# Altium project Common_Sensor_Box.PrjPCB (part 5 of 17)

## Sheet Sensor_Box_PoE.SchDoc: Title
size 420 x 297 mm; Author: G.Kasprowicz; CompanyName: WUT ISE; DrawnBy: G.Kasprowicz; Organization: WUT ISE; Address1: PW ISE; Address2: Nowowiejska 15/19 00-665 Warsaw; Address3: gkasprow@gmail.com; Revision: 1.0; SheetNumber: -; SheetTotal: -; ModifiedBy: -; CheckedDate: -; Title2: Title2; DivGrp: WUT ISE; Designer: G.Kasprowicz; ModifiedDate: -; ProjectName: Sensor Box
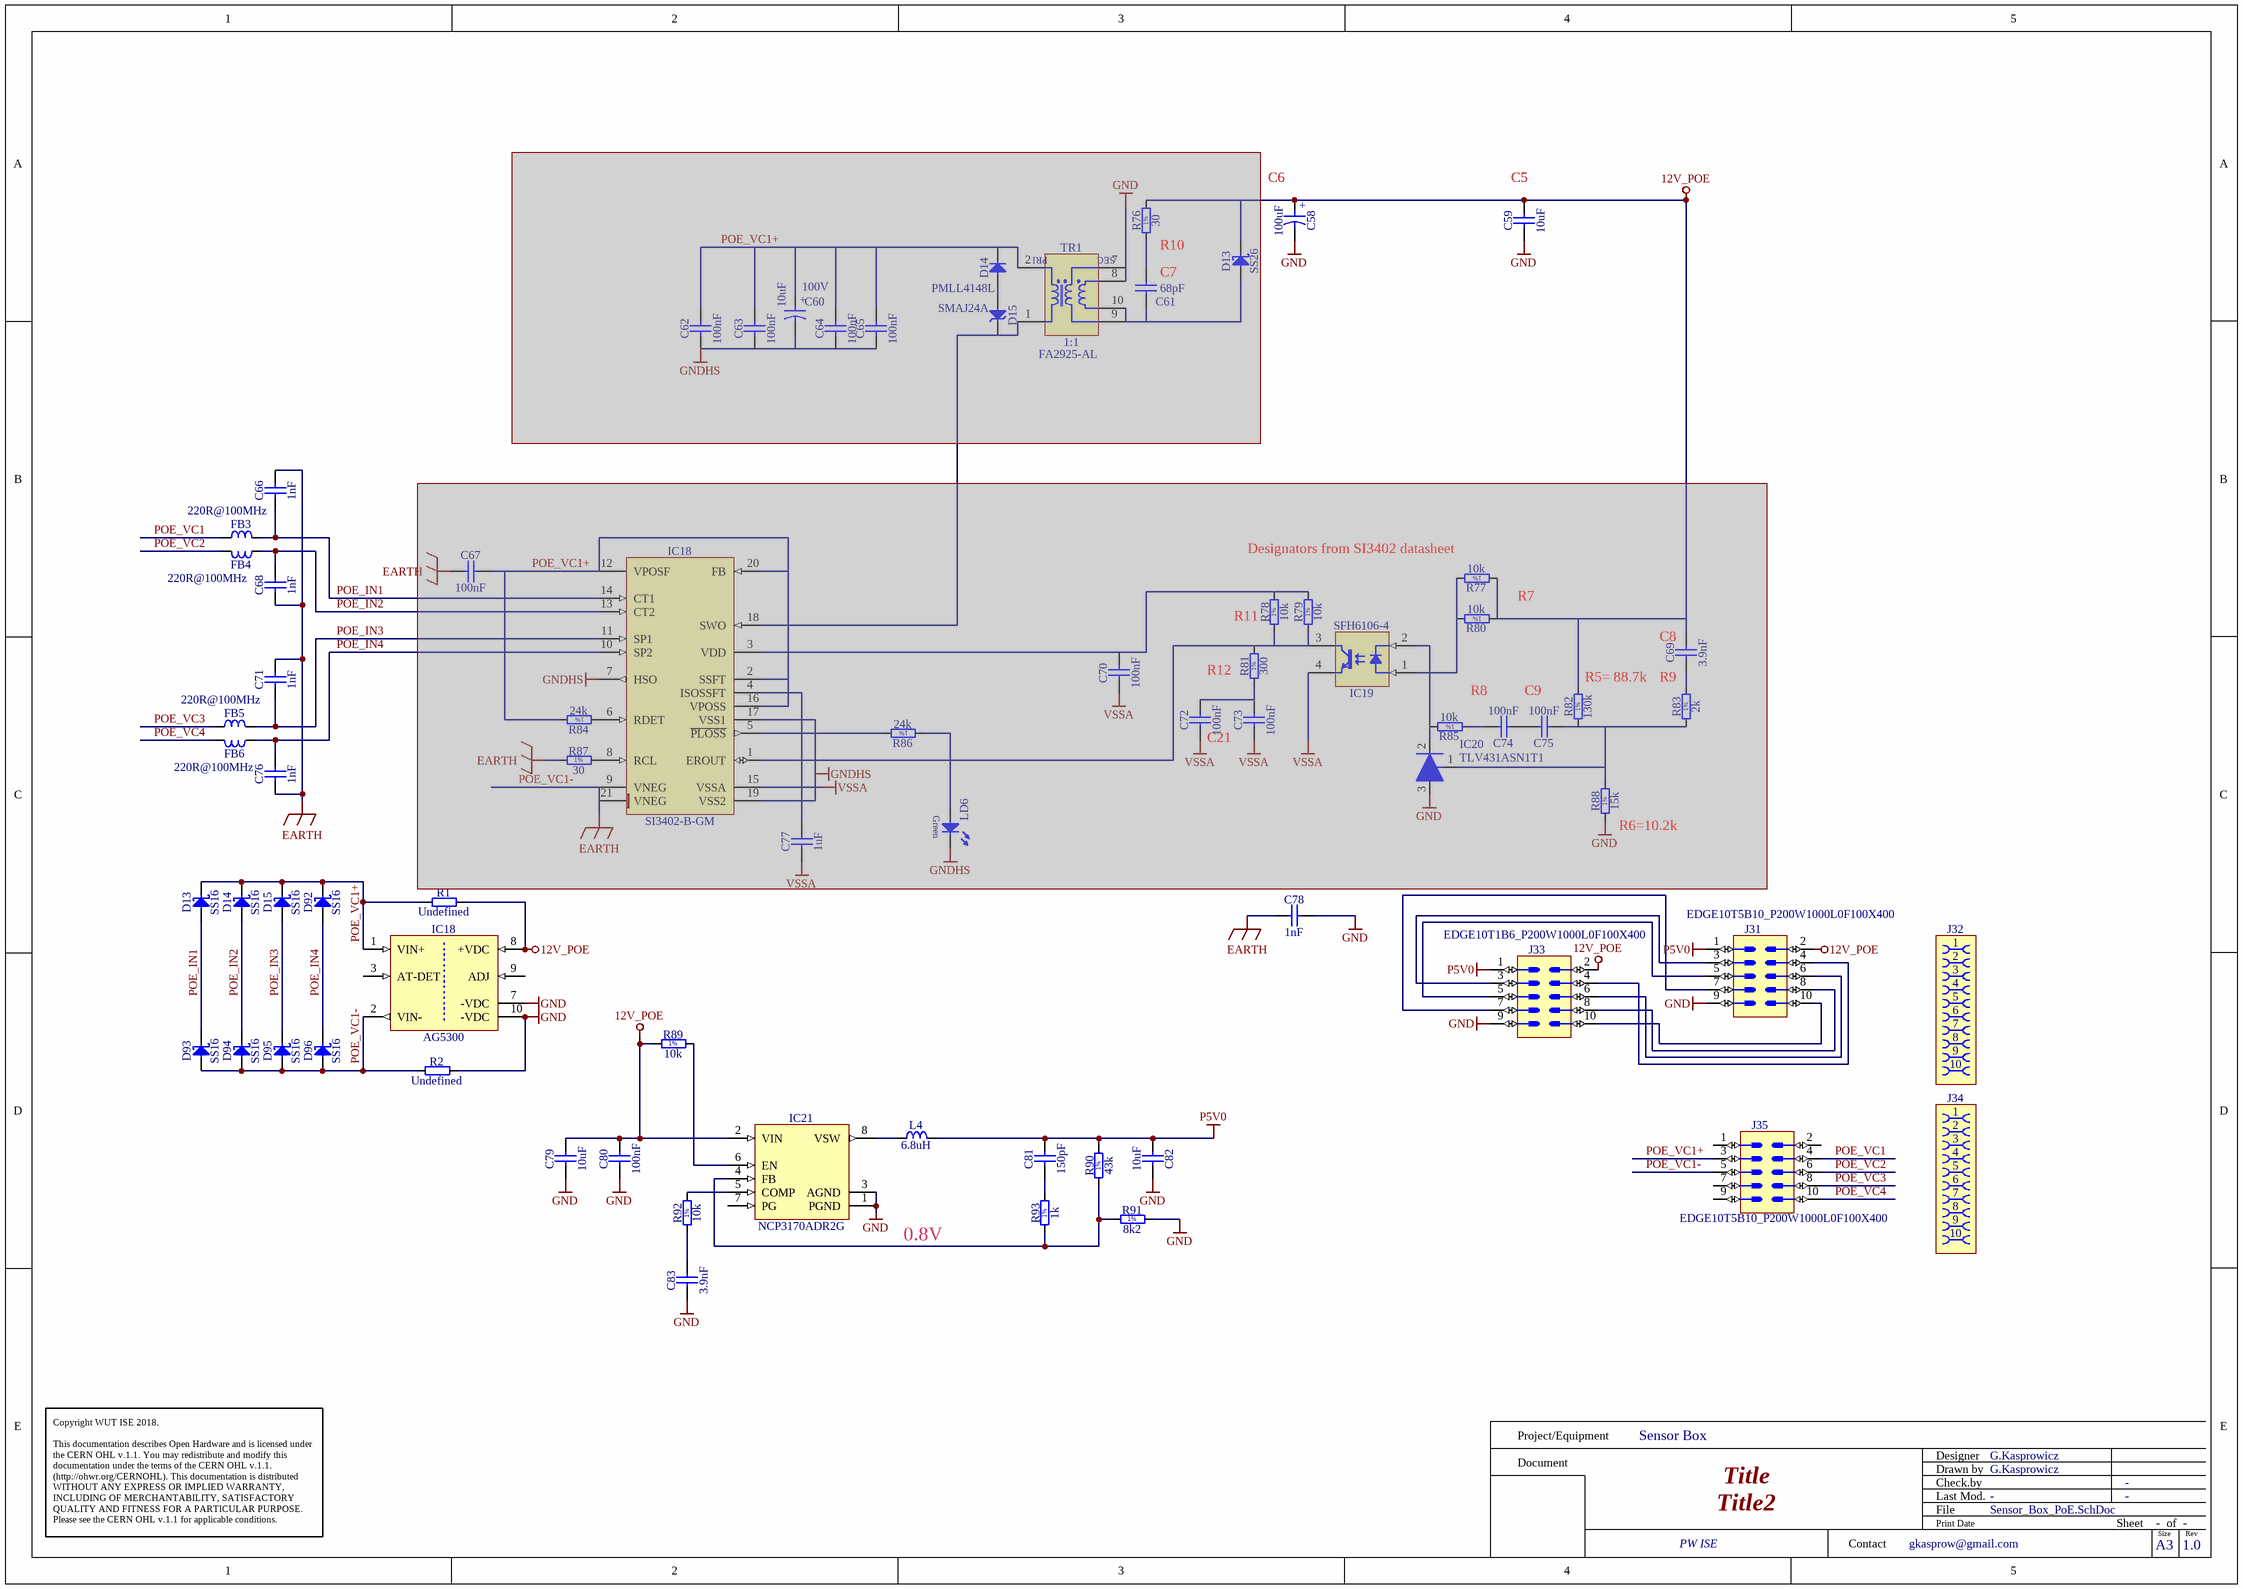
[diagram p7: Sensor_Box_PoE.SchDoc]

### Parts
(Parts that share a designator on the sheet are numbered #1, #2 ... from top to bottom, then left to right.)
C58  100uF  [CAPAE660X540N]
C59  10uF  [CAPC2012X135N]
C60#2  10uF  Voltage: 100V  [CAPAE830X1020N]  (masked out: inside a compile mask, not in the netlist)
C61#1  68pF  [CAPC1608X87N]  (masked out: inside a compile mask, not in the netlist)
C62#1  100nF  [CAPC3216X140N]  (masked out: inside a compile mask, not in the netlist)
C63#1  100nF  [CAPC3216X140N]  (masked out: inside a compile mask, not in the netlist)
C64#1  100nF  [CAPC3216X140N]  (masked out: inside a compile mask, not in the netlist)
C65#1  100nF  [CAPC3216X140N]  (masked out: inside a compile mask, not in the netlist)
C66  1nF  [CAPC1608X87N]
C67#1  100nF  [CAPC3216X140N]  (masked out: inside a compile mask, not in the netlist)
C68  1nF  [CAPC1608X87N]
C69#1  3.9nF  [CAPC1608X87N]  (masked out: inside a compile mask, not in the netlist)
C70#1  100nF  [CAPC1005X55N]  (masked out: inside a compile mask, not in the netlist)
C71  1nF  [CAPC1608X87N]
C72#1  100nF  [CAPC1005X55N]  (masked out: inside a compile mask, not in the netlist)
C73#1  100nF  [CAPC1005X55N]  (masked out: inside a compile mask, not in the netlist)
C74#1  100nF  [CAPC1005X55N]  (masked out: inside a compile mask, not in the netlist)
C75#1  100nF  [CAPC1005X55N]  (masked out: inside a compile mask, not in the netlist)
C76  1nF  [CAPC1608X87N]
C77#1  1uF  [CAPC1005X55N]  (masked out: inside a compile mask, not in the netlist)
C78  1nF  [CAPC3216X180N]
C79  10uF  [CAPC2012X135N]
C80  100nF  [CAPC1005X55N]
C81  150pF  [CAPC1608X87N]
C82  10uF  [CAPC2012X135N]
C83  3.9nF  [CAPC1608X87N]
D13#1  SS26  [DIOM5336X265N]  (masked out: inside a compile mask, not in the netlist)
D13#2  SS16  [DIOM5127X229N]
D14#1  PMLL4148L  [DIOMELF3515N]  (masked out: inside a compile mask, not in the netlist)
D14#2  SS16  [DIOM5127X229N]
D15#1  SMAJ24A  [DIOM5226X262N]  (masked out: inside a compile mask, not in the netlist)
D15#2  SS16  [DIOM5127X229N]
D92  SS16  [DIOM5127X229N]
D93  SS16  [DIOM5127X229N]
D94  SS16  [DIOM5127X229N]
D95  SS16  [DIOM5127X229N]
D96  SS16  [DIOM5127X229N]
FB3  220R@100MHz  [INDC2012X105N]
FB4  220R@100MHz  [INDC2012X105N]
FB5  220R@100MHz  [INDC2012X105N]
FB6  220R@100MHz  [INDC2012X105N]
IC18#1  SI3402-B-GM  [QFN80P500X500X80-21N-S280]  (masked out: inside a compile mask, not in the netlist)
IC18#2  AG5300  [SILVERTEL_AG5300]
IC19#1  SFH6106-4  [SOIC254P977X406-4N]  (masked out: inside a compile mask, not in the netlist)
IC20#1  TLV431ASN1T1  [SOT-23]  (masked out: inside a compile mask, not in the netlist)
IC21  NCP3170ADR2G  [SOIC127P600X175-8N]
J31  (no value)  [EDGE10T5B10_P200W1000L0F100X400]
J32  (no value)  [AVX_00 9159 010 061 916]
J33  (no value)  [EDGE10T1B6_P200W1000L0F100X400]
J34  (no value)  [AVX_00 9159 010 061 916]
J35  (no value)  [EDGE10T5B10_P200W1000L0F100X400]
L4  6.8uH  [IND_BOURNS_SRU8043]
LD6#1  Green  [LED_KINGBRIGHT_KPTR3216]  (value not drawn)  (masked out: inside a compile mask, not in the netlist)
R1  Undefined  [RESC3216X65N]
R2  Undefined  [RESC3216X65N]
R76#1  30  [RESC1608X55N]  (masked out: inside a compile mask, not in the netlist)
R77#1  10k  [RESC1005X40N]  (masked out: inside a compile mask, not in the netlist)
R78#1  10k  [RESC1005X40N]  (masked out: inside a compile mask, not in the netlist)
R79#1  10k  [RESC1005X40N]  (masked out: inside a compile mask, not in the netlist)
R80#1  10k  [RESC1005X40N]  (masked out: inside a compile mask, not in the netlist)
R81#1  300  [RESC1005X40N]  (masked out: inside a compile mask, not in the netlist)
R82#1  130k  [RESC1608X55N]  (masked out: inside a compile mask, not in the netlist)
R83#1  2k  [RESC1005X40N]  (masked out: inside a compile mask, not in the netlist)
R84#1  24k  [RESC1608X55N]  (masked out: inside a compile mask, not in the netlist)
R85#2  10k  [RESC1005X40N]  (masked out: inside a compile mask, not in the netlist)
R86#2  24k  [RESC1608X55N]  (masked out: inside a compile mask, not in the netlist)
R87#1  30  [RESC1608X55N]  (masked out: inside a compile mask, not in the netlist)
R88#1  15k  [RESC1608X55N]  (masked out: inside a compile mask, not in the netlist)
R89  10k  [RESC1005X40N]
R90  43k  [RESC1608X55N]
R91  8k2  [RESC1608X55N]
R92  10k  [RESC1005X40N]
R93  1k  [RESC1005X40N]
TR1  1:1  Manufacturer Part Number: FA2925-AL  [XFMR_COILCRAFT_FA2925-AL]  (masked out: inside a compile mask, not in the netlist)

### Nets
12V_POE: C58.1 C59.2 C79.2 C80.2 IC18#2.8(+VDC) IC21.2(VIN) J31.2 J33.2 R1.2 R89.1
EARTH: C66.2 C68.1 C71.2 C76.1 C78.1
GND: C58.2 C59.1 C78.2 C79.1 C80.1 C82.2 C83.1 IC18#2.7(-VDC) IC18#2.10(-VDC) IC21.1(PGND) IC21.3(AGND) J31.9 J33.9 R2.2 R91.2
P5V0: C81.2 C82.1 J31.1 J33.1 L4.2 R90.2
POE_IN1: C66.1 D13#2.2(A) D93.1(C) FB3.2
POE_IN2: C68.2 D14#2.2(A) D94.1(C) FB4.1
POE_IN3: C71.1 D15#2.2(A) D95.1(C) FB5.2
POE_IN4: C76.2 D92.2(A) D96.1(C) FB6.1
POE_VC1: FB3.1 J35.4
POE_VC1+: D13#2.1(C) D14#2.1(C) D15#2.1(C) D92.1(C) IC18#2.1(VIN+) J35.3 R1.1
POE_VC1-: D93.2(A) D94.2(A) D95.2(A) D96.2(A) IC18#2.2(VIN-) J35.5 R2.1
POE_VC2: FB4.2 J35.6
POE_VC3: FB5.1 J35.8
POE_VC4: FB6.2 J35.10
NetC81_1: C81.1 R93.2
NetC83_2: C83.2 R92.1
NetIC21_4: IC21.4(FB) R90.1 R91.1 R93.1
NetIC21_5: IC21.5(COMP) R92.2
NetIC21_6: IC21.6(EN) R89.2
NetIC21_8: IC21.8(VSW) L4.1
NetJ31_3: J31.3 J33.3
NetJ31_4: J31.4 J33.4
NetJ31_5: J31.5 J33.5
NetJ31_6: J31.6 J33.6
NetJ31_7: J31.7 J33.7
NetJ31_8: J31.8 J33.8
NetJ31_10: J31.10 J33.10

Not connected (* = marked no-connect by the designer): IC18#2 3(AT-DET) 9(ADJ); IC21 7(PG); J35 1 2 7 9

### Notes on the sheet
- (near C58) C6
- (near C59) C5
- (near R76#1) R10
- (near C61#1) C7
- (near R77#1) Designators from SI3402 datasheet
- R11
- R7
- (near C69#1) C8
- R12
- R8
- C9
- (near R82#1) R5= 88.7k
- R9
- (near C72#1) C21
- (near R88#1) R6=10.2k
- 0.8V
- Project/Equipment
- Document
- Designer
- Drawn by
- Check.by
- Copyright WUT ISE 2018.
  This documentation describes Open Hardware and is licensed under the CERN OHL v.1.1. You may redistribute and modify this documentation under the terms of the CERN OHL v.1.1. (http://ohwr.org/CERNOHL). This documentation is distributed WITHOUT ANY EXPRESS OR IMPLIED WARRANTY, INCLUDING OF MERCHANTABILITY, SATISFACTORY QUALITY AND FITNESS FOR A PARTICULAR PURPOSE. Please see the CERN OHL v.1.1 for applicable conditions.
- Contact
- File
- Last Mod.
- Print Date
- Sheet
- Size
- A3
- of
- Rev
- (in symbol CAE660-540_100UF_16V_20%) +
- (in symbol CAP_ELECTRO_SMD_F_10u_100V) +
- (in symbol R0402_1K_1%_0.0625W_100PPM) 1%
- (in symbol R0402_2K_1%_0.0625W_100PPM) 1%
- (in symbol R0402_10K_1%_0.0625W_100PPM) 1%
- (in symbol R0402_300R_1%_0.0625W_100PPM) 1%
- (in symbol R0603_8K2_1%_0.1W_100PPM) 1%
- (in symbol R0603_15K_1%_0.1W_100PPM) 1%
- (in symbol R0603_24K_1%_0.1W_100PPM) 1%
- (in symbol R0603_30R_1%_0.1W_100PPM) 1%
- (in symbol R0603_43K_1%_0.1W_100PPM) 1%
- (in symbol R0603_130K_1%_0.1W_100PPM) 1%
- (in symbol XFMR_COILCRAFT_FA2925-AL) PRI; SEC

### Library data of the parts
C58 = CAE660-540_100UF_16V_20%: Polarised capacitor; Part Description: Aluminum Electrolytic SMT Capacitor; Manufacturer: PANASONIC; Manufacturer Part Number: EEEFK1C101AP; Voltage: 16V; Tolerance: ±20%; Part Number: CAE660-540_100UF_16V_20%; Component Kind: Standard; Component Type: Standard; Pin Count: 2; Value: 100uF; Status: Not Recommended; Case: D; Mounted: Yes; Socket: No; SMD: Yes; Sense: No; ComponentHeight: 5.8mm; HelpURL: \\cern.ch\dfs\Applications\Altium\Datasheets\CAE_PANASONIC_FK.pdf; Author: CERN DEM JLC; CreateDate: 03.12.2007; LatestRevisionDate: 05.11.2014
C59 C79 C82 = CC0805_10UF_16V_10%_X5R: as C56 on sheet Sensor_Box_Hub_SAMD21; Part Number: CC0805_10UF_16V_10%_X5R; Component Kind: Standard; Component Type: Standard; Pin Count: 2; Value: 10uF; Status: Preferred; Manufacturer Part Number: CC0805_10UF_16V_10%_X5R; Case: 0805; Mounted: Yes; Socket: No; SMD: Yes; Sense: No; Manufacturer1 Example: KEMET; Manufacturer1 ComponentHeight: 1.4mm; HelpURL: \\cern.ch\dfs\Applications\Altium\Datasheets\CC1206_X5R_KEMET.pdf; Author: CERN DEM JLC; CreateDate: 03.12.2007; LatestRevisionDate: 03.12.2007
C60#2 = CAP_ELECTRO_SMD_F_10u_100V: 10uF, 100V, 1.5R; Part Number: CAE830-1020_10UF_100V_20%; Part Description: Aluminum Electrolytic SMT Capacitor; Manufacturer: PANASONIC; Manufacturer Part Number: EEEHD2A100P; Tolerance: ±20%; Table: Capacitors SMD; Component Kind: Standard; Component Type: Standard; Pin Count: 2; Value: 10uF; Status: Recommended; Case: F; Mounted: Yes; Socket: No; SMD: Yes; ComponentHeight: 10.2mm; HelpURL: \\cern.ch\dfs\Applications\Altium\Datasheets\CAE_PANASONIC_FK.pdf; Author: CERN DEM JLC; CreateDate: 2007-12-03; LatestRevisionDate: 2014-11-05
C61#1 = CC0603_68PF_50V_5%_NP0: as C57 on sheet Sensor_Box_Hub_SAMD21; Part Number: CC0603_68PF_50V_5%_NP0; Component Kind: Standard; Component Type: Standard; Pin Count: 2; Value: 68pF; Status: Preferred; Manufacturer Part Number: CC0603_68PF_50V_5%_NP0; Case: 0603; Mounted: Yes; Socket: No; SMD: Yes; Sense: No; Manufacturer1 Example: PHYCOMP; Manufacturer1 ComponentHeight: 0.87mm; HelpURL: \\cern.ch\dfs\Applications\Altium\Datasheets\CC0603_NP0_PHYCOMP.pdf; Author: CERN DEM JLC; CreateDate: 03.12.2007; LatestRevisionDate: 03.12.2007
C62#1 C63#1 C64#1 C65#1 C67#1 = CC1206_100NF_100V_10%_X7R: Non-polarised capacitor; Part Description: SMD Multilayer Chip Ceramic Capacitor; Manufacturer: GENERIC; Manufacturer1 Part Number: 222260115649; Voltage: 100V; TC: X7R; Tolerance: ±10%; Part Number: CC1206_100NF_100V_10%_X7R; Component Kind: Standard; Component Type: Standard; Pin Count: 2; Value: 100nF; Status: Preferred; Manufacturer Part Number: CC1206_100NF_100V_10%_X7R; Case: 1206; Mounted: Yes; Socket: No; SMD: Yes; Sense: No; Manufacturer1 Example: PHYCOMP; Manufacturer1 ComponentHeight: 1.25mm; HelpURL: \\cern.ch\dfs\Applications\Altium\Datasheets\CC1206_X7R_PHYCOMP.pdf; Author: CERN DEM JLC; CreateDate: 24.08.2009; LatestRevisionDate: 24.08.2009
C66 C68 C71 C76 = CC0603_1NF_100V_10%_X7R: Non-polarised capacitor; Part Description: SMD Multilayer Chip Ceramic Capacitor; Manufacturer: GENERIC; Manufacturer1 Part Number: C0603C102K1RACTU; Voltage: 100V; TC: X7R; Tolerance: ±10%; Part Number: CC0603_1NF_100V_10%_X7R; Component Kind: Standard; Component Type: Standard; Pin Count: 2; Value: 1nF; Status: Preferred; Manufacturer Part Number: CC0603_1NF_100V_10%_X7R; Case: 0603; Mounted: Yes; Socket: No; SMD: Yes; Sense: No; Manufacturer1 Example: KEMET; Manufacturer1 ComponentHeight: 0.87mm; HelpURL: \\cern.ch\dfs\Applications\Altium\Datasheets\CC0603_X7R_KEMET.pdf; Author: CERN DEM JLC; CreateDate: 12.12.2013; LatestRevisionDate: 12.12.2013
C69#1 C83 = CC0603_3.9NF_50V_5%_X7R: Non-polarised capacitor; Part Description: SMD Multilayer Chip Ceramic Capacitor; Manufacturer: GENERIC; Manufacturer1 Part Number: 223858615631; Voltage: 50V; TC: X7R; Tolerance: ±5%; Part Number: CC0603_3.9NF_50V_5%_X7R; Component Kind: Standard; Component Type: Standard; Pin Count: 2; Value: 3.9nF; Status: Preferred; Manufacturer Part Number: CC0603_3.9NF_50V_5%_X7R; Case: 0603; Mounted: Yes; Socket: No; SMD: Yes; Sense: No; Manufacturer1 Example: PHYCOMP; Manufacturer1 ComponentHeight: 0.87mm; HelpURL: \\cern.ch\dfs\Applications\Altium\Datasheets\CC0603_X7R_PHYCOMP.pdf; Author: CERN DEM JLC; CreateDate: 03.12.2007; LatestRevisionDate: 03.12.2007
C70#1 C72#1 C73#1 C74#1 C75#1 C80 = CC0402_100NF_16V_10%_X5R: as C41 on sheet Sensor_Box_Hub_SAMD21; Part Number: CC0402_100NF_16V_10%_X5R; Component Kind: Standard; Component Type: Standard; Pin Count: 2; Value: 100nF; Status: None; Manufacturer Part Number: CC0402_100NF_16V_10%_X5R; Case: 0402; Mounted: Yes; Socket: No; SMD: Yes; Sense: No; Manufacturer1 Example: MURATA; Manufacturer1 ComponentHeight: 0.55mm; HelpURL: \\cern.ch\dfs\Applications\Altium\Datasheets\CC0402_X5R_MURATA_GRM.pdf; Author: CERN DEM JLC; CreateDate: 10.12.2013; LatestRevisionDate: 10.12.2013
C77#1 = CC0402_1UF_16V_10%_X5R: as C55 on sheet Sensor_Box_Hub_SAMD21; Part Number: CC0402_1UF_16V_10%_X5R; Component Kind: Standard; Component Type: Standard; Pin Count: 2; Value: 1uF; Status: Preferred; Manufacturer Part Number: CC0402_1UF_16V_10%_X5R; Case: 0402; Mounted: Yes; Socket: No; SMD: Yes; Sense: No; Manufacturer1 Example: TDK; Manufacturer1 ComponentHeight: 0.55mm; HelpURL: \\cern.ch\dfs\Applications\Altium\Datasheets\CC0402_X5R_TDK_C.pdf; Author: CERN DEM JLC; CreateDate: 25.10.2012; LatestRevisionDate: 25.10.2012
C78 = CC1206_1NF_2KV_10%_X7R: Non-polarised capacitor; Part Description: High Voltage MLC Chip Capacitor; Manufacturer: GENERIC; Manufacturer1 Part Number: 1206GC102KAT2A; Voltage: 2kV; TC: X7R; Tolerance: ±10%; Part Number: CC1206_1NF_2KV_10%_X7R; Component Kind: Standard; Component Type: Standard; Pin Count: 2; Value: 1nF; Status: None; Manufacturer Part Number: CC1206_1NF_2KV_10%_X7R; Case: 1206; Mounted: Yes; Socket: No; SMD: Yes; Sense: No; Manufacturer1 Example: AVX; Manufacturer1 ComponentHeight: 1.8mm; HelpURL: \\cern.ch\dfs\Applications\Altium\Datasheets\CC1206_X7R_AVX_HV-MLC.pdf; Author: CERN DEM JLC; CreateDate: 19.11.2012; LatestRevisionDate: 17.05.2017
C81 = CC0603_150PF_50V_1%_NP0: Non-polarised capacitor; Part Description: SMD Multilayer Chip Ceramic Capacitor; Manufacturer: GENERIC; Manufacturer1 Part Number: CC0603FRNPO9BN151; Voltage: 50V; TC: C0G/NP0; Tolerance: ±1%; Part Number: CC0603_150PF_50V_1%_NP0; Component Kind: Standard; Component Type: Standard; Pin Count: 2; Value: 150pF; Status: None; Manufacturer Part Number: CC0603_150PF_50V_1%_NP0; Case: 0603; Mounted: Yes; Socket: No; SMD: Yes; Sense: No; Manufacturer1 Example: PHYCOMP; Manufacturer1 ComponentHeight: 0.7mm; HelpURL: \\cern.ch\dfs\Applications\Altium\Datasheets\CC0805_NP0_PHYCOMP_16VTO50V.pdf; Author: CERN DEM MR; CreateDate: 17.02.2016; LatestRevisionDate: 17.02.2016
D13#1 = SS26: Schottky Diode; Part Description: Schottky Rectifier; Manufacturer: FAIRCHILD SEMICONDUCTOR; Voltage: 60V; Power: 2A; PressFit: No; Bonding: No; Part Number: SS26; Component Kind: Standard; Component Type: Standard; Device: SS26; PackageDescription: DO-214-AA/SMB Diode, Molded Body; 5.34mm L X 3.625mm W X 2.65mm H, IPC Medium Density; Manufacturer Part Number: SS26; Pin Count: 2; Case: DO-214AA; Mounted: Yes; Socket: No; SMD: Yes; Sense: No; ComponentHeight: 2.65mm; HelpURL: \\cern.ch\dfs\Applications\Altium\Datasheets\SS26.pdf; Author: CERN DEM JMW; CreateDate: 10.07.2015; LatestRevisionDate: 10.07.2015
D13#2 D14#2 D15#2 D92-D96 = SS16: Schottky Diode; Part Description: Surface Mount Schottky Barrier Rectifier; Manufacturer: VISHAY GENERAL SEMICONDUCTOR; Voltage: 60V; Power: 1A; PressFit: No; Bonding: No; Part Number: SS16; Component Kind: Standard; Component Type: Standard; Device: SS16; PackageDescription: DO-214-AC Molded Diode, Body 5.1x2.7mm, IPC Medium Density; Manufacturer Part Number: SS16; Pin Count: 2; Case: DO-214AC; Mounted: Yes; Socket: No; SMD: Yes; Sense: No; ComponentHeight: 2.29mm; HelpURL: \\cern.ch\dfs\Applications\Altium\Datasheets\SS16.pdf; Author: CERN DEM JLC; CreateDate: 15.07.2008; LatestRevisionDate: 23.08.2010
D14#1 = PMLL4148L: Diode; Part Description: High-speed switching diodes; Manufacturer: NXP SEMICONDUCTORS; Voltage: 75V; Power: 200mA; PressFit: No; Bonding: No; Part Number: PMLL4148L; Component Kind: Standard; Component Type: Standard; Device: PMLL4148L; PackageDescription: SOD80C, MELF Diode, 2-Leads, Body 3.5x1.5mm, IPC Medium Density; Status: Not recommended; Manufacturer Part Number: PMLL4148L; Pin Count: 2; Case: SOD-80C; Mounted: Yes; Socket: No; SMD: Yes; Sense: No; ComponentHeight: 1.6mm; HelpURL: \\cern.ch\dfs\Applications\Altium\Datasheets\PMLL4148L.pdf; Author: CERN DEM JLC; CreateDate: 30.03.2009; LatestRevisionDate: 09.12.2009
D15#1 = SMAJ24A: Transient Voltage Suppressor Diode (Uni-Directional); Part Description: Surface Mount Uni-directional Transient Voltage Suppressor Diode; Manufacturer: BOURNS; Voltage: 24V; Power: 400W; PressFit: No; Bonding: No; Part Number: SMAJ24A; Component Kind: Standard; Component Type: Standard; Device: SMAJ24A; PackageDescription: DO-214-AC/SMA Diode, Molded Body; 5.21mm L X 2.605mm W X 2.62mm H, IPC Medium Density; Manufacturer Part Number: SMAJ24A; Pin Count: 2; Case: DO-214AC; Mounted: Yes; Socket: No; SMD: Yes; Sense: No; ComponentHeight: 2.62mm; HelpURL: \\cern.ch\dfs\Applications\Altium\Datasheets\SMAJ24A.pdf; Author: CERN DEM JLC; CreateDate: 27.06.2011; LatestRevisionDate: 27.06.2011
FB3-FB6 = IND0805_MURATA_BLM21PG221SN1D: as FB2 on sheet Sensor_Box_Hub_SAMD21; Part Number: IND0805_MURATA_BLM21PG221SN1D; Component Kind: Standard; Component Type: Standard; Pin Count: 2; Value: 220R@100MHz; Status: None; Manufacturer Part Number: BLM21PG221SN1D; Case: 0805; Mounted: Yes; Socket: No; SMD: Yes; ComponentHeight: 1.05mm; HelpURL: \\cern.ch\dfs\Applications\Altium\Datasheets\IND0402_MURATA_BLM21P.pdf; Author: CERN DEM JLC; CreateDate: 2010-01-25; LatestRevisionDate: 2010-01-25
IC18#1 = SI3402-B-GM: Fully Integrated IEEE 802.3 Compliant PoE PD Interface and Low-EMI Switching Regulator; Manufacturer: SILICON LABS; PressFit: No; Bonding: No; Part Number: SI3402-B-GM; Component Kind: Standard; Component Type: Standard; Device: SI3402-B-GM; PackageDescription: QFN, 0.80mm Pitch, Square 20 Pin, 5.00mm L X 5.00mm W X 0.80mm H body (W/Thermal Tab 2.8mm X 2.8mm), IPC Medium Density; Part Description: Fully Integrated IEEE 802.3 Compliant PoE PD Interface and Low-EMI Switching Regulator; Manufacturer Part Number: SI3402-B-GM; Pin Count: 21; Case: QFN20; Mounted: Yes; Socket: No; SMD: Yes; Sense: No; ComponentHeight: 0.8mm; HelpURL: \\cern.ch\dfs\Applications\Altium\Datasheets\SI3402-B-GM.pdf; Author: CERN DEM MR; CreateDate: 21.02.2018; LatestRevisionDate: 21.02.2018
IC18#2 = AG5300: Power-over-Ethernet Plus (POE+) Module; Part Description: 12V 30W Power-over-Ethernet Plus (POE+); Manufacturer: SILVERTEL; PressFit: No; Bonding: No; Part Number: AG5300; Component Kind: Standard; Component Type: Standard; Device: AG5300; PackageDescription: Power-over-Ethernet Plus (POE+) Module, Body L 57.3mm x W 18mm x H 14mm; Manufacturer Part Number: AG5300; Pin Count: 10; Mounted: Yes; Socket: No; SMD: No; Sense: No; ComponentHeight: 14mm; HelpURL: \\cern.ch\dfs\Applications\Altium\Datasheets\AG5300.pdf; Author: CERN DEM JLC; CreateDate: 20.03.2018; LatestRevisionDate: 20.03.2018
IC19#1 = SFH6106-4: Single Optocoupler; Part Description: Optocoupler, Phototransistor Output, High Reliability, 5300 VRMS; Manufacturer: VISHAY SEMICONDUCTORS; PressFit: No; Bonding: No; Part Number: SFH6106-4; Component Kind: Standard; Component Type: Standard; Device: SFH6106-4; PackageDescription: SOIC, 2.54mm pitch; 4 pin, 6.65mm W X 4.69mm L, IPC Medium Density; Manufacturer Part Number: SFH6106-4; Pin Count: 4; Case: SOIC4; Mounted: Yes; Socket: No; SMD: Yes; Sense: No; ComponentHeight: 4.06mm; HelpURL: \\cern.ch\dfs\Applications\Altium\Datasheets\SFH6106-4.pdf; Author: CERN DEM MR; CreateDate: 15.02.2018; LatestRevisionDate: 15.02.2018
IC20#1 = REF_TLV431_SOT23_16V: 16V 1.24V ADJ Voltage reference; Supplier 1: Newark; Supplier Part Number 1: 31K7719
IC21 = NCP3170ADR2G: Synchronous PWM Switching Converter; Manufacturer: ON SEMICONDUCTOR; PressFit: No; Bonding: No; Part Number: NCP3170ADR2G; Component Kind: Standard; Component Type: Standard; Device: NCP3170ADR2G; PackageDescription: SOIC 8, Pitch 1.27mm - Body 4x5mm, IPC Medium Density; Part Description: Synchronous PWM Switching Converter; Manufacturer Part Number: NCP3170ADR2G; Pin Count: 8; Case: SOIC8; Mounted: Yes; Socket: No; SMD: Yes; Sense: No; ComponentHeight: 1.75mm; Author: CERN DEM MR; HelpURL: \\cern.ch\dfs\Applications\Altium\Datasheets\NCP3170ADR2G.pdf; CreateDate: 30.05.2016; LatestRevisionDate: 30.05.2016
J31 J35 = EDGE10T5B10_P200W1000L0F100X400: as J26 on sheet Sensor_Box_Hub_SAMD21; Part Number: EDGE10T5B10_P200W1000L0F100X400; Component Kind: Standard (No BOM); Component Type: Standard (No BOM); Pin Count: 10; Socket: No; SMD: No; Sense: No; Status: None; ComponentHeight: 0mm; HelpURL: \\cern.ch\dfs\Applications\Altium\Datasheets\EDGE10T5B10_P200W1000L0F100X400.pdf; Author: CERN DEM MR; CreateDate: 14.02.2018; LatestRevisionDate: 14.02.2018
J32 J34 = AVX_00 9159 010 061 916: Open Ended Card Edge Connector, 9159 Series; Part Description: 10 Contacts, 2mm Pitch, Open Ended Card Edge Connector, 9159 Series; Manufacturer: AVX; PressFit: No; Part Number: AVX_00 9159 010 061 916; Component Kind: Standard; Component Type: Standard; Pin Count: 10; Mounted: Yes; Socket: No; SMD: No; Sense: No; Status: None; Manufacturer Part Number: 00 9159 010 061 916; ComponentHeight: 1.6mm; HelpURL: \\cern.ch\dfs\Applications\Altium\Datasheets\AVX_00 9159 010 061 916.pdf; Author: CERN DEM MR; CreateDate: 13.02.2018; LatestRevisionDate: 13.02.2018
J33 = EDGE10T1B6_P200W1000L0F100X400: as J27 on sheet Sensor_Box_Hub_SAMD21; Part Number: EDGE10T1B6_P200W1000L0F100X400; Component Kind: Standard (No BOM); Component Type: Standard (No BOM); Pin Count: 10; Socket: No; SMD: No; Sense: No; Status: None; ComponentHeight: 0mm; HelpURL: \\cern.ch\dfs\Applications\Altium\Datasheets\EDGE10T1B6_P200W1000L0F100X400.pdf; Author: CERN DEM MR; CreateDate: 14.02.2018; LatestRevisionDate: 14.02.2018
L4 = IND_6.8UH_30%_BOURNS_SRU8043: Inductor; Part Description: Shielded SMD Power Inductor; Manufacturer: BOURNS; Manufacturer Part Number: SRU8043-6R8Y; Power: 3.8A; Resistance: 0.0224R; Tolerance: ±30%; Part Number: IND_6.8UH_30%_BOURNS_SRU8043; Component Kind: Standard; Component Type: Standard; Pin Count: 2; Value: 6.8uH; Status: None; Mounted: Yes; Socket: No; SMD: Yes; Sense: No; ComponentHeight: 4.6mm; HelpURL: \\cern.ch\dfs\Applications\Altium\Datasheets\IND_BOURNS_SRU8043.pdf; Author: CERN DEM JMW; CreateDate: 06.08.2015; LatestRevisionDate: 06.08.2015
LD6#1 = LED_KINGBRIGHT_KPTR-3216CGCK: as LD3-LD5 on sheet Sensor_Box_Hub_SAMD21; Part Number: LED_KINGBRIGHT_KPTR-3216CGCK; Component Kind: Standard; Component Type: Standard; Color: Green; PackageDescription: Reverse Mount LED 3216, Hole 2.1x2.3mm 0.35mm Height; Manufacturer: KINGBRIGHT; Manufacturer Part Number: KPTR-3216CGCK; Pin Count: 2; Mounted: Yes; Socket: No; SMD: Yes; Sense: No; ComponentHeight: 0.35mm; HelpURL: \\cern.ch\dfs\Applications\Altium\Datasheets\LED_KINGBRIGHT_KPTR-3216CGCK.pdf; Author: CERN DEM MR; CreateDate: 15.02.2016; LatestRevisionDate: 15.02.2016
R1 R2 = R1206_NO-VALUE: Resistor; Part Description: Reserved Footprint For a 1206 (3216) Chip Resistor; PressFit: No; Mounted: No; Part Number: R1206_NO-VALUE; Component Kind: Standard; Component Type: Standard; Pin Count: 2; Value: Undefined; Status: None; Manufacturer: Undefined; Manufacturer Part Number: R1206_NO-VALUE; Case: 1206; Sense: No; Socket: No; SMD: Yes; Manufacturer1 Example: Undefined; Manufacturer1 Part Number: Undefined; Manufacturer1 ComponentHeight: 0.65mm; HelpURL: Undefined; Author: CERN DEM JLC; CreateDate: 03.12.2007; LatestRevisionDate: 13.03.2008
R76#1 R87#1 = R0603_30R_1%_0.1W_100PPM: Resistor - 1%; Part Description: General Purpose Thick Film Chip Resistor; Manufacturer: GENERIC; Manufacturer1 Part Number: NRC06F30R0TRF; Power: 0.1W; TC: ±100ppm/°C; PressFit: No; Part Number: R0603_30R_1%_0.1W_100PPM; Component Kind: Standard; Component Type: Standard; Pin Count: 2; Value: 30; Status: Preferred; Tolerance: ±1%; Manufacturer Part Number: R0603_30R_1%_0.1W_100PPM; Case: 0603; Mounted: Yes; Sense: No; Socket: No; SMD: Yes; Manufacturer1 Example: NIC COMPONENT; Manufacturer1 ComponentHeight: 0.55mm; HelpURL: \\cern.ch\dfs\Applications\Altium\Datasheets\R0603_NIC_NRC.pdf; Author: CERN DEM JLC; CreateDate: 03.12.2007; LatestRevisionDate: 13.03.2008
R77#1 R78#1 R79#1 R80#1 R85#2 R89 R92 = R0402_10K_1%_0.0625W_100PPM: as R56 on sheet Sensor_Box_Hub_SAMD21; Part Number: R0402_10K_1%_0.0625W_100PPM; Component Kind: Standard; Component Type: Standard; Pin Count: 2; Value: 10k; Status: Not Recommended; Power: 0.0625W; Tolerance: ±1%; Manufacturer Part Number: R0402_10K_1%_0.0625W_100PPM; Case: 0402; Mounted: Yes; Sense: No; Socket: No; SMD: Yes; Manufacturer1 Example: YAGEO PHYCOMP; Manufacturer1 ComponentHeight: 0.4mm; HelpURL: \\cern.ch\dfs\Applications\Altium\Datasheets\R0402_Phycomp_RC0402.pdf; Author: CERN DEM JLC; CreateDate: 03.12.2007; LatestRevisionDate: 17.10.2012
R81#1 = R0402_300R_1%_0.0625W_100PPM: Resistor - 1%; Part Description: General Purpose Thick Film Chip Resistor; Manufacturer: GENERIC; Manufacturer1 Part Number: 232270673001L; TC: ±100ppm/°C; PressFit: No; Part Number: R0402_300R_1%_0.0625W_100PPM; Component Kind: Standard; Component Type: Standard; Pin Count: 2; Value: 300; Status: Not Recommended; Power: 0.0625W; Tolerance: ±1%; Manufacturer Part Number: R0402_300R_1%_0.0625W_100PPM; Case: 0402; Mounted: Yes; Sense: No; Socket: No; SMD: Yes; Manufacturer1 Example: YAGEO PHYCOMP; Manufacturer1 ComponentHeight: 0.4mm; HelpURL: \\cern.ch\dfs\Applications\Altium\Datasheets\R0402_Phycomp_RC0402.pdf; Author: CERN DEM JLC; CreateDate: 03.12.2007; LatestRevisionDate: 17.10.2012
R82#1 = R0603_130K_1%_0.1W_100PPM: Resistor - 1%; Part Description: General Purpose Thick Film Chip Resistor; Manufacturer: GENERIC; Manufacturer1 Part Number: NRC06F1303TRF; Power: 0.1W; TC: ±100ppm/°C; PressFit: No; Part Number: R0603_130K_1%_0.1W_100PPM; Component Kind: Standard; Component Type: Standard; Pin Count: 2; Value: 130k; Status: Preferred; Tolerance: ±1%; Manufacturer Part Number: R0603_130K_1%_0.1W_100PPM; Case: 0603; Mounted: Yes; Sense: No; Socket: No; SMD: Yes; Manufacturer1 Example: NIC COMPONENT; Manufacturer1 ComponentHeight: 0.55mm; HelpURL: \\cern.ch\dfs\Applications\Altium\Datasheets\R0603_NIC_NRC.pdf; Author: CERN DEM JLC; CreateDate: 03.12.2007; LatestRevisionDate: 13.03.2008
R83#1 = R0402_2K_1%_0.0625W_100PPM: Resistor - 1%; Part Description: General Purpose Thick Film Chip Resistor; Manufacturer: GENERIC; Manufacturer1 Part Number: 232270672002L; TC: ±100ppm/°C; PressFit: No; Part Number: R0402_2K_1%_0.0625W_100PPM; Component Kind: Standard; Component Type: Standard; Pin Count: 2; Value: 2k; Status: Not Recommended; Power: 0.0625W; Tolerance: ±1%; Manufacturer Part Number: R0402_2K_1%_0.0625W_100PPM; Case: 0402; Mounted: Yes; Sense: No; Socket: No; SMD: Yes; Manufacturer1 Example: YAGEO PHYCOMP; Manufacturer1 ComponentHeight: 0.4mm; HelpURL: \\cern.ch\dfs\Applications\Altium\Datasheets\R0402_Phycomp_RC0402.pdf; Author: CERN DEM JLC; CreateDate: 03.12.2007; LatestRevisionDate: 17.10.2012
R84#1 R86#2 = R0603_24K_1%_0.1W_100PPM: Resistor - 1%; Part Description: General Purpose Thick Film Chip Resistor; Manufacturer: GENERIC; Manufacturer1 Part Number: NRC06F2402TRF; Power: 0.1W; TC: ±100ppm/°C; PressFit: No; Part Number: R0603_24K_1%_0.1W_100PPM; Component Kind: Standard; Component Type: Standard; Pin Count: 2; Value: 24k; Status: Preferred; Tolerance: ±1%; Manufacturer Part Number: R0603_24K_1%_0.1W_100PPM; Case: 0603; Mounted: Yes; Sense: No; Socket: No; SMD: Yes; Manufacturer1 Example: NIC COMPONENT; Manufacturer1 ComponentHeight: 0.55mm; HelpURL: \\cern.ch\dfs\Applications\Altium\Datasheets\R0603_NIC_NRC.pdf; Author: CERN DEM JLC; CreateDate: 03.12.2007; LatestRevisionDate: 13.03.2008
R88#1 = R0603_15K_1%_0.1W_100PPM: Resistor - 1%; Part Description: General Purpose Thick Film Chip Resistor; Manufacturer: GENERIC; Manufacturer1 Part Number: NRC06F1502TRF; Power: 0.1W; TC: ±100ppm/°C; PressFit: No; Part Number: R0603_15K_1%_0.1W_100PPM; Component Kind: Standard; Component Type: Standard; Pin Count: 2; Value: 15k; Status: Preferred; Tolerance: ±1%; Manufacturer Part Number: R0603_15K_1%_0.1W_100PPM; Case: 0603; Mounted: Yes; Sense: No; Socket: No; SMD: Yes; Manufacturer1 Example: NIC COMPONENT; Manufacturer1 ComponentHeight: 0.55mm; HelpURL: \\cern.ch\dfs\Applications\Altium\Datasheets\R0603_NIC_NRC.pdf; Author: CERN DEM JMW; CreateDate: 17.08.2015; LatestRevisionDate: 17.08.2015
R90 = R0603_43K_1%_0.1W_100PPM: Resistor - 1%; Part Description: General Purpose Thick Film Chip Resistor; Manufacturer: GENERIC; Manufacturer1 Part Number: NRC06F4302TRF; Power: 0.1W; TC: ±100ppm/°C; PressFit: No; Part Number: R0603_43K_1%_0.1W_100PPM; Component Kind: Standard; Component Type: Standard; Pin Count: 2; Value: 43k; Status: Preferred; Tolerance: ±1%; Manufacturer Part Number: R0603_43K_1%_0.1W_100PPM; Case: 0603; Mounted: Yes; Sense: No; Socket: No; SMD: Yes; Manufacturer1 Example: NIC COMPONENT; Manufacturer1 ComponentHeight: 0.55mm; HelpURL: \\cern.ch\dfs\Applications\Altium\Datasheets\R0603_NIC_NRC.pdf; Author: CERN DEM JLC; CreateDate: 03.12.2007; LatestRevisionDate: 13.03.2008
R91 = R0603_8K2_1%_0.1W_100PPM: Resistor - 1%; Part Description: General Purpose Thick Film Chip Resistor; Manufacturer: GENERIC; Manufacturer1 Part Number: NRC06F8201TRF; Power: 0.1W; TC: ±100ppm/°C; PressFit: No; Part Number: R0603_8K2_1%_0.1W_100PPM; Component Kind: Standard; Component Type: Standard; Pin Count: 2; Value: 8k2; Status: Preferred; Tolerance: ±1%; Manufacturer Part Number: R0603_8K2_1%_0.1W_100PPM; Case: 0603; Mounted: Yes; Sense: No; Socket: No; SMD: Yes; Manufacturer1 Example: NIC COMPONENT; Manufacturer1 ComponentHeight: 0.55mm; HelpURL: \\cern.ch\dfs\Applications\Altium\Datasheets\R0603_NIC_NRC.pdf; Author: CERN DEM JLC; CreateDate: 03.12.2007; LatestRevisionDate: 13.03.2008
R93 = R0402_1K_1%_0.0625W_100PPM: as R12 on sheet Sensor_Box_Hub_SAMD21; Part Number: R0402_1K_1%_0.0625W_100PPM; Component Kind: Standard; Component Type: Standard; Pin Count: 2; Value: 1k; Status: Not Recommended; Power: 0.0625W; Tolerance: ±1%; Manufacturer Part Number: R0402_1K_1%_0.0625W_100PPM; Case: 0402; Mounted: Yes; Sense: No; Socket: No; SMD: Yes; Manufacturer1 Example: YAGEO PHYCOMP; Manufacturer1 ComponentHeight: 0.4mm; HelpURL: \\cern.ch\dfs\Applications\Altium\Datasheets\R0402_Phycomp_RC0402.pdf; Author: CERN DEM JLC; CreateDate: 03.12.2007; LatestRevisionDate: 17.10.2012
TR1 = XFMR_COILCRAFT_FA2925-AL: Flyback Transformer; Part Description: Flyback Transformer For Silicon Laboratories Si3402 PD Controller; Part Number: XFMR_COILCRAFT_FA2925-AL; Component Kind: Standard; Component Type: Standard; Pin Count: 10; Value: 1:1; Status: None; Manufacturer: COILCRAFT; Mounted: Yes; Socket: No; Sense: No; SMD: Yes; ComponentHeight: 12.7mm; HelpURL: \\cern.ch\dfs\Applications\Altium\Datasheets\XFMR_COILCRAFT_FA2925-AL.pdf; Author: CERN DEM MR; CreateDate: 14.02.2018; LatestRevisionDate: 14.02.2018

## Sheet Sensor_Box_PWR_AC.SchDoc: Title
size 420 x 297 mm; Author: G.Kasprowicz; CompanyName: WUT ISE; DrawnBy: G.Kasprowicz; Organization: WUT ISE; Address1: PW ISE; Address2: Nowowiejska 15/19 00-665 Warsaw; Address3: gkasprow@gmail.com; Revision: 1.0; SheetNumber: -; SheetTotal: -; ModifiedBy: -; CheckedDate: -; Title2: Title2; DivGrp: WUT ISE; Designer: G.Kasprowicz; ModifiedDate: -; ProjectName: Sensor Box
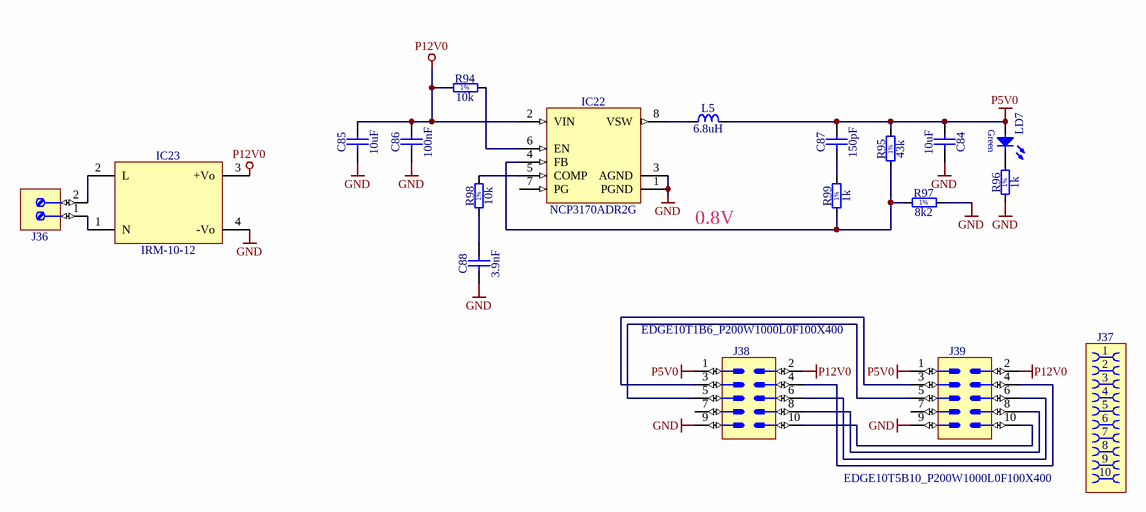
[diagram p8: Sensor_Box_PWR_AC.SchDoc]

### Parts
C84  10uF  [CAPC2012X135N]
C85  10uF  [CAPC2012X135N]
C86  100nF  [CAPC1005X55N]
C87  150pF  [CAPC1608X87N]
C88  3.9nF  [CAPC1608X87N]
IC22  NCP3170ADR2G  [SOIC127P600X175-8N]
IC23  IRM-10-12  [PWS_MEANWELL_IRM-10]
J36  (no value)  [PHOENIX_1751248]
J37  (no value)  [AVX_00 9159 010 061 916]
J38  (no value)  [EDGE10T1B6_P200W1000L0F100X400]
J39  (no value)  [EDGE10T5B10_P200W1000L0F100X400]
L5  6.8uH  [IND_BOURNS_SRU8043]
LD7  Green  [LED_KINGBRIGHT_KPTR3216]  (value not drawn)
R94  10k  [RESC1005X40N]
R95  43k  [RESC1608X55N]
R96  1k  [RESC1005X40N]
R97  8k2  [RESC1608X55N]
R98  10k  [RESC1005X40N]
R99  1k  [RESC1005X40N]

### Nets
GND: C84.2 C85.1 C86.1 C88.1 IC22.1(PGND) IC22.3(AGND) IC23.4(-Vo) J38.9 J39.9 R96.1 R97.2
P5V0: C84.1 C87.2 J38.1 J39.1 L5.2 LD7.2(A) R95.2
P12V0: C85.2 C86.2 IC22.2(VIN) IC23.3(+Vo) J38.2 J39.2 R94.1
NetC87_1: C87.1 R99.2
NetC88_2: C88.2 R98.1
NetIC22_4: IC22.4(FB) R95.1 R97.1 R99.1
NetIC22_5: IC22.5(COMP) R98.2
NetIC22_6: IC22.6(EN) R94.2
NetIC22_8: IC22.8(VSW) L5.1
NetIC23_1: IC23.1(N) J36.1
NetIC23_2: IC23.2(L) J36.2
NetJ38_3: J38.3 J39.3
NetJ38_4: J38.4 J39.4
NetJ38_5: J38.5 J39.5
NetJ38_6: J38.6 J39.6
NetJ38_8: J38.8 J39.8
NetJ38_10: J38.10 J39.10
NetLD7_1: LD7.1(C) R96.2

Not connected (* = marked no-connect by the designer): IC22 7(PG); J38 7; J39 7

### Notes on the sheet
- 0.8V
- Project/Equipment
- Document
- Designer
- Drawn by
- Check.by
- Copyright WUT ISE 2018.
  This documentation describes Open Hardware and is licensed under the CERN OHL v.1.1. You may redistribute and modify this documentation under the terms of the CERN OHL v.1.1. (http://ohwr.org/CERNOHL). This documentation is distributed WITHOUT ANY EXPRESS OR IMPLIED WARRANTY, INCLUDING OF MERCHANTABILITY, SATISFACTORY QUALITY AND FITNESS FOR A PARTICULAR PURPOSE. Please see the CERN OHL v.1.1 for applicable conditions.
- Contact
- File
- Last Mod.
- Print Date
- Sheet
- Size
- A3
- of
- Rev
- (in symbol R0402_1K_1%_0.0625W_100PPM) 1%
- (in symbol R0402_10K_1%_0.0625W_100PPM) 1%
- (in symbol R0603_8K2_1%_0.1W_100PPM) 1%
- (in symbol R0603_43K_1%_0.1W_100PPM) 1%

### Library data of the parts
C84 C85 = CC0805_10UF_16V_10%_X5R: as C56 on sheet Sensor_Box_Hub_SAMD21; Part Number: CC0805_10UF_16V_10%_X5R; Component Kind: Standard; Component Type: Standard; Pin Count: 2; Value: 10uF; Status: Preferred; Manufacturer Part Number: CC0805_10UF_16V_10%_X5R; Case: 0805; Mounted: Yes; Socket: No; SMD: Yes; Manufacturer1 Example: KEMET; Manufacturer1 ComponentHeight: 1.4mm; HelpURL: \\cern.ch\dfs\Applications\Altium\Datasheets\CC1206_X5R_KEMET.pdf; Author: CERN DEM JLC; CreateDate: 03.12.2007; LatestRevisionDate: 03.12.2007; Sense: No
C86 = CC0402_100NF_16V_10%_X5R: as C41 on sheet Sensor_Box_Hub_SAMD21; Part Number: CC0402_100NF_16V_10%_X5R; Component Kind: Standard; Component Type: Standard; Pin Count: 2; Value: 100nF; Status: None; Manufacturer Part Number: CC0402_100NF_16V_10%_X5R; Case: 0402; Mounted: Yes; Socket: No; SMD: Yes; Sense: No; Manufacturer1 Example: MURATA; Manufacturer1 ComponentHeight: 0.55mm; HelpURL: \\cern.ch\dfs\Applications\Altium\Datasheets\CC0402_X5R_MURATA_GRM.pdf; Author: CERN DEM JLC; CreateDate: 10.12.2013; LatestRevisionDate: 10.12.2013
C87 = CC0603_150PF_50V_1%_NP0: as C81 on sheet Sensor_Box_PoE; Part Number: CC0603_150PF_50V_1%_NP0; Component Kind: Standard; Component Type: Standard; Pin Count: 2; Value: 150pF; Status: None; Manufacturer Part Number: CC0603_150PF_50V_1%_NP0; Case: 0603; Mounted: Yes; Socket: No; SMD: Yes; Sense: No; Manufacturer1 Example: PHYCOMP; Manufacturer1 ComponentHeight: 0.7mm; HelpURL: \\cern.ch\dfs\Applications\Altium\Datasheets\CC0805_NP0_PHYCOMP_16VTO50V.pdf; Author: CERN DEM MR; CreateDate: 17.02.2016; LatestRevisionDate: 17.02.2016
C88 = CC0603_3.9NF_50V_5%_X7R: as C69#1 on sheet Sensor_Box_PoE; Part Number: CC0603_3.9NF_50V_5%_X7R; Component Kind: Standard; Component Type: Standard; Pin Count: 2; Value: 3.9nF; Status: Preferred; Manufacturer Part Number: CC0603_3.9NF_50V_5%_X7R; Case: 0603; Mounted: Yes; Socket: No; SMD: Yes; Sense: No; Manufacturer1 Example: PHYCOMP; Manufacturer1 ComponentHeight: 0.87mm; HelpURL: \\cern.ch\dfs\Applications\Altium\Datasheets\CC0603_X7R_PHYCOMP.pdf; Author: CERN DEM JLC; CreateDate: 03.12.2007; LatestRevisionDate: 03.12.2007
IC22 = NCP3170ADR2G: as IC21 on sheet Sensor_Box_PoE; Part Number: NCP3170ADR2G; Component Kind: Standard; Component Type: Standard; Device: NCP3170ADR2G; PackageDescription: SOIC 8, Pitch 1.27mm - Body 4x5mm, IPC Medium Density; Part Description: Synchronous PWM Switching Converter; Manufacturer Part Number: NCP3170ADR2G; Pin Count: 8; Case: SOIC8; Mounted: Yes; Socket: No; SMD: Yes; Sense: No; ComponentHeight: 1.75mm; Author: CERN DEM MR; HelpURL: \\cern.ch\dfs\Applications\Altium\Datasheets\NCP3170ADR2G.pdf; CreateDate: 30.05.2016; LatestRevisionDate: 30.05.2016
IC23 = IRM-10-12: Power Supply; Part Description: 85-264VAC To 12VDC (850mA) 10.2W Power Supply; Manufacturer: MEAN WELL; PressFit: No; Bonding: No; Part Number: IRM-10-12; Component Kind: Standard; Component Type: Standard; Device: IRM-10-12; PackageDescription: IRM-10 Series, Body 45.7x25.4mm, Power Supply; Status: None; Manufacturer Part Number: IRM-10-12; Pin Count: 4; Mounted: Yes; Socket: No; SMD: No; Sense: No; ComponentHeight: 21.5mm; HelpURL: \\cern.ch\dfs\Applications\Altium\Datasheets\IRM-10-12.pdf; Author: CERN DEM MR; CreateDate: 14.02.2018; LatestRevisionDate: 14.02.2018
J36 = PHOENIX_1751248: Terminal Block, 2 Positions, Screw Connection; Part Description: 10A 160V, Terminal Block, Pitch 3.5mm, 2 Positions, Screw Connection; Manufacturer: PHOENIX CONTACT; Manufacturer Part Number: 1751248 (MKDS 1/ 2-3,5); PressFit: No; Part Number: PHOENIX_1751248; Component Kind: Standard; Component Type: Standard; Pin Count: 2; Mounted: Yes; Socket: No; SMD: No; Sense: No; Status: None; ComponentHeight: 8.5mm; HelpURL: \\cern.ch\dfs\Applications\Altium\Datasheets\PHOENIX_1751248.pdf; Author: CERN DEM JLC; CreateDate: 03.11.2009; LatestRevisionDate: 26.04.2010
J37 = AVX_00 9159 010 061 916: as J32 on sheet Sensor_Box_PoE; Part Number: AVX_00 9159 010 061 916; Component Kind: Standard; Component Type: Standard; Pin Count: 10; Mounted: Yes; Socket: No; SMD: No; Sense: No; Status: None; Manufacturer Part Number: 00 9159 010 061 916; ComponentHeight: 1.6mm; HelpURL: \\cern.ch\dfs\Applications\Altium\Datasheets\AVX_00 9159 010 061 916.pdf; Author: CERN DEM MR; CreateDate: 13.02.2018; LatestRevisionDate: 13.02.2018
J38 = EDGE10T1B6_P200W1000L0F100X400: as J27 on sheet Sensor_Box_Hub_SAMD21; Part Number: EDGE10T1B6_P200W1000L0F100X400; Component Kind: Standard (No BOM); Component Type: Standard (No BOM); Pin Count: 10; Socket: No; SMD: No; Sense: No; Status: None; ComponentHeight: 0mm; HelpURL: \\cern.ch\dfs\Applications\Altium\Datasheets\EDGE10T1B6_P200W1000L0F100X400.pdf; Author: CERN DEM MR; CreateDate: 14.02.2018; LatestRevisionDate: 14.02.2018
J39 = EDGE10T5B10_P200W1000L0F100X400: as J26 on sheet Sensor_Box_Hub_SAMD21; Part Number: EDGE10T5B10_P200W1000L0F100X400; Component Kind: Standard (No BOM); Component Type: Standard (No BOM); Pin Count: 10; Socket: No; SMD: No; Sense: No; Status: None; ComponentHeight: 0mm; HelpURL: \\cern.ch\dfs\Applications\Altium\Datasheets\EDGE10T5B10_P200W1000L0F100X400.pdf; Author: CERN DEM MR; CreateDate: 14.02.2018; LatestRevisionDate: 14.02.2018
L5 = IND_6.8UH_30%_BOURNS_SRU8043: as L4 on sheet Sensor_Box_PoE; Part Number: IND_6.8UH_30%_BOURNS_SRU8043; Component Kind: Standard; Component Type: Standard; Pin Count: 2; Value: 6.8uH; Status: None; Mounted: Yes; Socket: No; SMD: Yes; Sense: No; ComponentHeight: 4.6mm; HelpURL: \\cern.ch\dfs\Applications\Altium\Datasheets\IND_BOURNS_SRU8043.pdf; Author: CERN DEM JMW; CreateDate: 06.08.2015; LatestRevisionDate: 06.08.2015
LD7 = LED_KINGBRIGHT_KPTR-3216CGCK: as LD3-LD5 on sheet Sensor_Box_Hub_SAMD21; Part Number: LED_KINGBRIGHT_KPTR-3216CGCK; Component Kind: Standard; Component Type: Standard; Color: Green; PackageDescription: Reverse Mount LED 3216, Hole 2.1x2.3mm 0.35mm Height; Manufacturer: KINGBRIGHT; Manufacturer Part Number: KPTR-3216CGCK; Pin Count: 2; Mounted: Yes; Socket: No; SMD: Yes; Sense: No; ComponentHeight: 0.35mm; HelpURL: \\cern.ch\dfs\Applications\Altium\Datasheets\LED_KINGBRIGHT_KPTR-3216CGCK.pdf; Author: CERN DEM MR; CreateDate: 15.02.2016; LatestRevisionDate: 15.02.2016
R94 R98 = R0402_10K_1%_0.0625W_100PPM: as R56 on sheet Sensor_Box_Hub_SAMD21; Part Number: R0402_10K_1%_0.0625W_100PPM; Component Kind: Standard; Component Type: Standard; Pin Count: 2; Value: 10k; Status: Not Recommended; Power: 0.0625W; Tolerance: ±1%; Manufacturer Part Number: R0402_10K_1%_0.0625W_100PPM; Case: 0402; Mounted: Yes; Sense: No; Socket: No; SMD: Yes; Manufacturer1 Example: YAGEO PHYCOMP; Manufacturer1 ComponentHeight: 0.4mm; HelpURL: \\cern.ch\dfs\Applications\Altium\Datasheets\R0402_Phycomp_RC0402.pdf; Author: CERN DEM JLC; CreateDate: 03.12.2007; LatestRevisionDate: 17.10.2012
R95 = R0603_43K_1%_0.1W_100PPM: as R90 on sheet Sensor_Box_PoE; Part Number: R0603_43K_1%_0.1W_100PPM; Component Kind: Standard; Component Type: Standard; Pin Count: 2; Value: 43k; Status: Preferred; Tolerance: ±1%; Manufacturer Part Number: R0603_43K_1%_0.1W_100PPM; Case: 0603; Mounted: Yes; Sense: No; Socket: No; SMD: Yes; Manufacturer1 Example: NIC COMPONENT; Manufacturer1 ComponentHeight: 0.55mm; HelpURL: \\cern.ch\dfs\Applications\Altium\Datasheets\R0603_NIC_NRC.pdf; Author: CERN DEM JLC; CreateDate: 03.12.2007; LatestRevisionDate: 13.03.2008
R96 R99 = R0402_1K_1%_0.0625W_100PPM: as R12 on sheet Sensor_Box_Hub_SAMD21; Part Number: R0402_1K_1%_0.0625W_100PPM; Component Kind: Standard; Component Type: Standard; Pin Count: 2; Value: 1k; Status: Not Recommended; Power: 0.0625W; Tolerance: ±1%; Manufacturer Part Number: R0402_1K_1%_0.0625W_100PPM; Case: 0402; Mounted: Yes; Sense: No; Socket: No; SMD: Yes; Manufacturer1 Example: YAGEO PHYCOMP; Manufacturer1 ComponentHeight: 0.4mm; HelpURL: \\cern.ch\dfs\Applications\Altium\Datasheets\R0402_Phycomp_RC0402.pdf; Author: CERN DEM JLC; CreateDate: 03.12.2007; LatestRevisionDate: 17.10.2012
R97 = R0603_8K2_1%_0.1W_100PPM: as R91 on sheet Sensor_Box_PoE; Part Number: R0603_8K2_1%_0.1W_100PPM; Component Kind: Standard; Component Type: Standard; Pin Count: 2; Value: 8k2; Status: Preferred; Tolerance: ±1%; Manufacturer Part Number: R0603_8K2_1%_0.1W_100PPM; Case: 0603; Mounted: Yes; Sense: No; Socket: No; SMD: Yes; Manufacturer1 Example: NIC COMPONENT; Manufacturer1 ComponentHeight: 0.55mm; HelpURL: \\cern.ch\dfs\Applications\Altium\Datasheets\R0603_NIC_NRC.pdf; Author: CERN DEM JLC; CreateDate: 03.12.2007; LatestRevisionDate: 13.03.2008